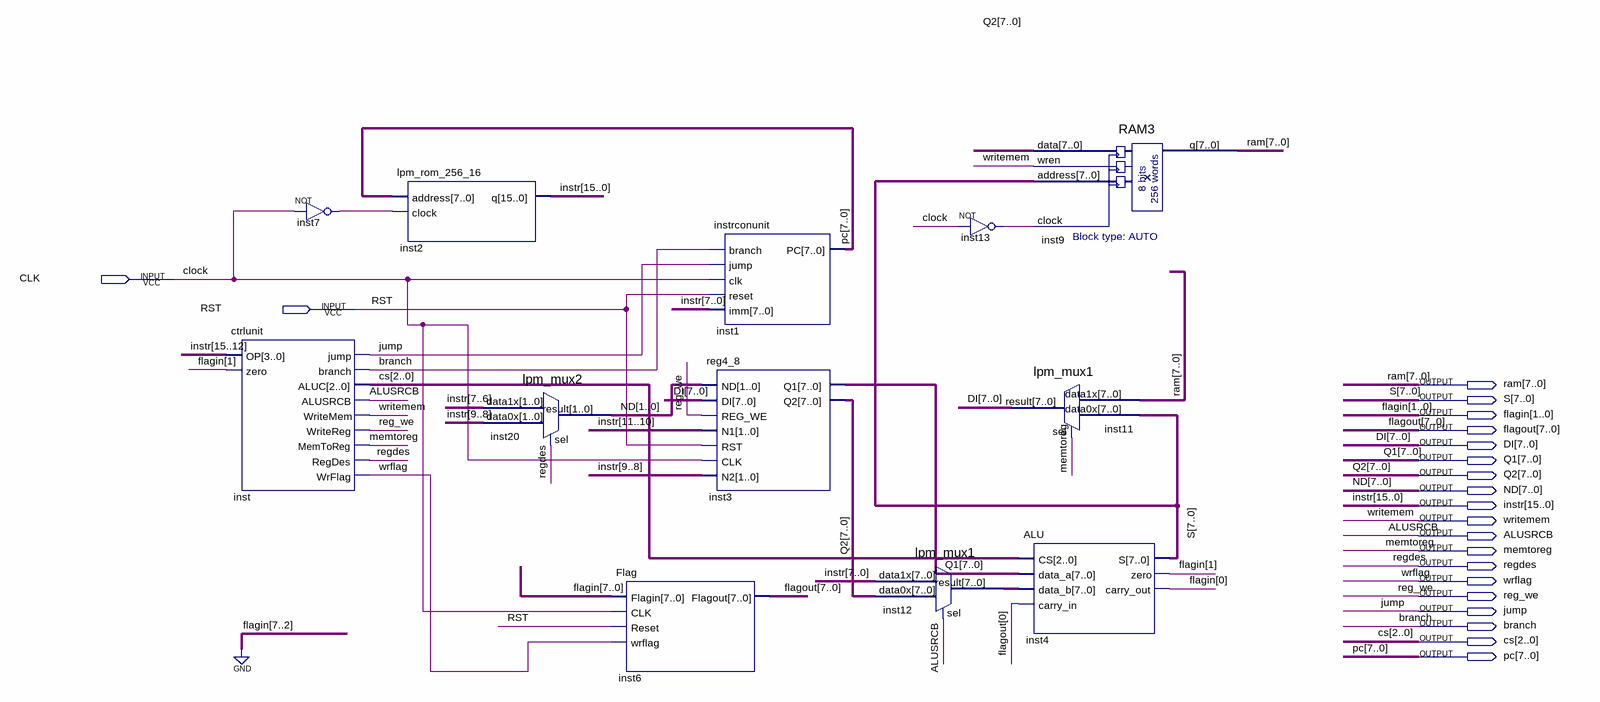
[diagram p0: schematic sheet]
// Quartus schematic systemA.bdf as structural Verilog: 12 symbols, 21 pins
module systemA (
  input  CLK,
  input  RST,
  output [7:0] ram,
  output [7:0] S,
  output [1:0] flagin,
  output [7:0] flagout,
  output [7:0] DI,
  output [7:0] Q1,
  output [7:0] Q2,
  output [7:0] ND,
  output [15:0] instr,
  output writemem,
  output ALUSRCB,
  output memtoreg,
  output regdes,
  output wrflag,
  output reg_we,
  output jump,
  output branch,
  output [2:0] cs,
  output [7:0] pc
);

  wire inst7_out, inst13_out;
  wire [7:0] inst12_result;

  ctrlunit inst (
    .OP(instr[15:12]), .zero(flagin[1]), .jump(jump), .branch(branch), .ALUC(cs), .ALUSRCB(ALUSRCB),
    .WriteMem(writemem), .WriteReg(reg_we), .MemToReg(memtoreg), .RegDes(regdes), .WrFlag(wrflag));
  not inst7 (inst7_out, CLK);
  lpm_rom_256_16 inst2 (.address(pc), .clock(inst7_out), .q(instr));
  lpm_mux2 inst20 (.data1x(instr[7:6]), .data0x(instr[9:8]), .sel(regdes), .result(ND[1:0]));
  Flag inst6 (.Flagin({{6{1'b0}}, flagin}), .CLK(CLK), .Reset(RST), .wrflag(wrflag), .Flagout(flagout));
  instrconunit inst1 (.branch(branch), .jump(jump), .clk(CLK), .reset(RST), .imm(instr[7:0]), .PC(pc));
  reg4_8 inst3 (
    .ND(ND[1:0]), .DI(DI), .REG_WE(reg_we), .N1(instr[11:10]), .RST(RST), .CLK(CLK), .N2(instr[9:8]),
    .Q1(Q1), .Q2(Q2));
  lpm_mux1 inst12 (.data1x(instr[7:0]), .data0x(Q2), .sel(ALUSRCB), .result(inst12_result));
  not inst13 (inst13_out, CLK);
  RAM3 inst9 (.data(Q2), .wren(writemem), .address(S), .clock(inst13_out), .q(ram));
  lpm_mux1 inst11 (.data1x(ram), .data0x(S), .sel(memtoreg), .result(DI));
  ALU inst4 (
    .CS(cs), .data_a(Q1), .data_b(inst12_result), .carry_in(flagout[0]), .S(S), .zero(flagin[1]),
    .carry_out(flagin[0]));

  // Other names for the same wires on the sheet: clock = CLK
endmodule
